# Altium schematic sheet crystal.schdoc
size A4
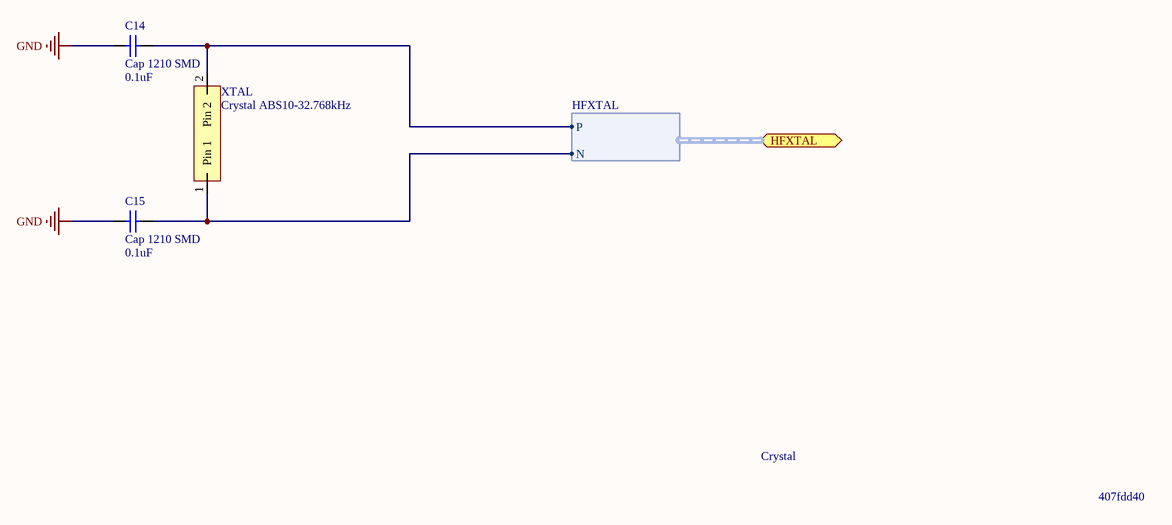
[diagram p0: crystal.schdoc]

## Parts
C14  Cap 1210 SMD  value 0.1uF  [CAPC1210(3225)100_L]
C15  Cap 1210 SMD  value 0.1uF  [CAPC1210(3225)100_L]
XTAL  Crystal ABS10-32.768kHz  [crystal-ABS10-32.768KHZ-T]

## Ports
HFXTAL (harness HFXTAL)

## Harnesses
HFXTAL: P, N

## Nets
GND: C14.2 C15.1
NetC14_1: C14.1 XTAL.2(Pin_2) ; port HFXTAL.P
NetC15_2: C15.2 XTAL.1(Pin_1) ; port HFXTAL.N

## Notes on the sheet
- Crystal
- 407fdd40

## Library data of the parts
C14 C15 = CMP-1038-00186-1: CAP 0.1uF 100V ±1% 1210 (3225 Metric) Thickness 1mm SMD; Case-EIA: 1210; Case-Metric: 3225; Rated Voltage: 100 V; Technology: SMT; Tolerance: ±1%; Max Thickness: 1 mm